# EAGLE design pcb-name-card (EAGLE 7.5.0)
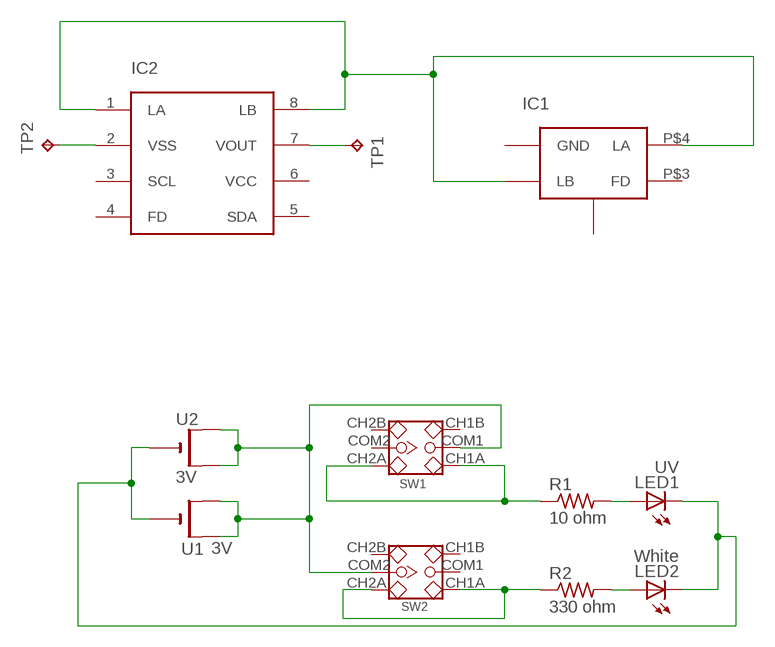
[diagram p0: schematic, sheet 1]

## Parts
IC1  NTAG21XFDRC-FIT  [HXSON4-SMALL]
IC2  NT3H1X01W0FTT  [TSSOP-8]
LED1  UV  LY_T679-D2E2-1  [PLCC2]
LED2  White  LY_T679-D2E2-1  [PLCC2]
R1  10 ohm  R-US_R2010  [R2010]
R2  330 ohm  R-US_R2010  [R2010]
SW1  SMD-TOGGLE-SWITCH-2CH(2X3P-7X3.5MM)  [SW6-2.54-SMD-7.0X3.5X1.5MM]
SW2  SMD-TOGGLE-SWITCH-2CH(2X3P-7X3.5MM)  [SW6-2.54-SMD-7.0X3.5X1.5MM]
TP1  VOUT  TPB2,54  [B2,54]
TP2  GND  TPB2,54  [B2,54]
U1  3V  CR2032SMT  [CR2032-SMD]
U2  3V  CR2032SMT  [CR2032-SMD]

## Nets
N$1: LED1.A R1.2
N$2: LED2.A R2.2
N$4: R1.1 SW1.CH1A SW1.CH2A
N$5: R2.1 SW2.CH1A SW2.CH2A
N$6: IC1.P$2(LB) IC1.P$4(LA) IC2.1(LA) IC2.8(LB)
N$7: LED1.C LED2.C U1.- U2.-
N$9: SW1.COM1 SW2.COM2 U1.+$1(+) U1.+$2(+1) U2.+$1(+) U2.+$2(+1)
N$10: IC2.2(VSS) TP2.TP
N$93: IC2.7(VOUT) TP1.TP
Unconnected: IC1.P$1(GND) IC1.P$3(FD) IC1.P$5(FLOAT) IC2.3(SCL) IC2.4(FD) IC2.5(SDA) IC2.6(VCC) SW1.CH1B SW1.CH2B SW1.COM2 SW2.CH1B SW2.CH2B SW2.COM1

## Library data of the parts
IC1 = ntag21xf:NTAG21XF
IC2 = ntagi2c:NT3H1X01
LED1 LED2 = led:*_T679-?-1: LC TOPLED® Low Current LED Source: http://catalog.osram-os.com .. LG_LS_LY_T679_OBS.pdf; COLOR: yellow
R1 R2 = resistor:R-US_: RESISTOR, American symbol
SW1 SW2 = Seeed-OPL-Switch:SMD-TOGGLE-SWITCH-2CH(2X3P-7X3.5MM): 311030005; MPN: MS-22C01
TP1 TP2 = testpad:TP: Test pad
U1 U2 = cr2032-large-side:CR2032

## Board
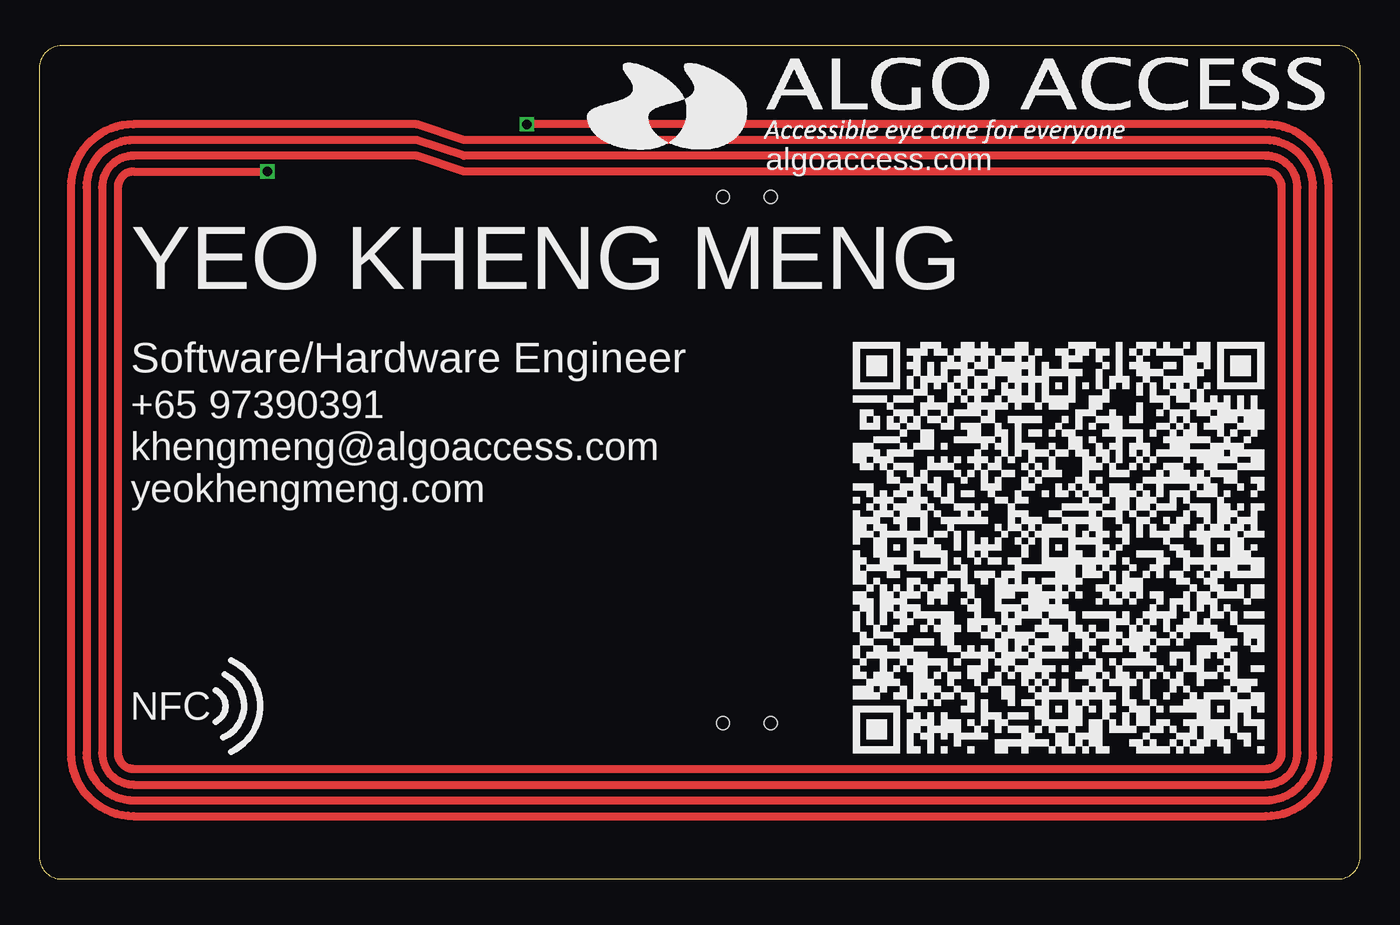
[diagram p1: board, top side]
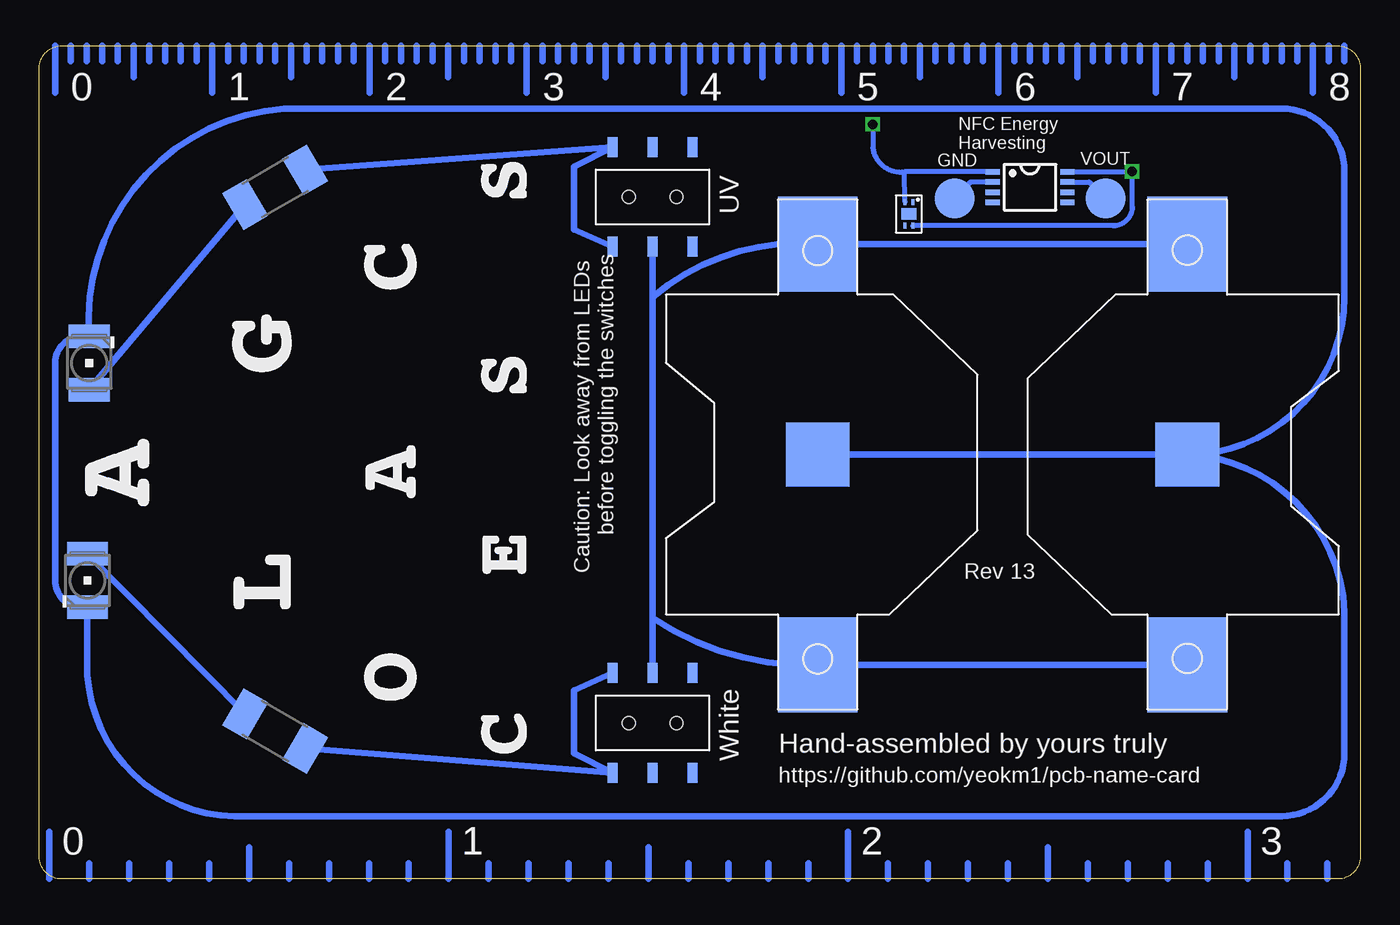
[diagram p2: board, bottom side, seen from below]

Size 84 x 53 mm. Coordinates in mm from the lower left corner, seen from the top.
Outline: 1.41,0 82.59,0 arc90 84,1.41 84,51.59 arc90 82.59,53 1.41,53 arc90 0,51.59 0,1.41 arc90 1.41,0
Copper layers (1*16): Top 0.035mm / dielectric 1.5mm / Bottom 0.035mm
Design rules "Elecrow_2-layer_eagle_rule": minimum track width 6mil, minimum drill 12mil, track to track 6mil, track to pad 6mil, pad to pad 6mil, via to via 6mil, smd to smd 0mil, copper to edge 10mil, drill to drill 10mil, minimum pad ring 10mil, minimum via ring 6mil, stop-mask expansion 2mil, vias tented up to drill 100mil, thermal gap 10mil

### Footprints (pad centres in the part's own frame; a part is rotated, then mirrored left to right if it is on the bottom)
HXSON4-SMALL = smd 0.4 x 0.2: P$1 -0.75,0.25; P$2 -0.75,-0.25; P$3 0.75,-0.25; P$4 0.75,0.25 | smd 0.75 x 0.95: P$5 0,0
TSSOP-8 = smd 0.9 x 0.35: 1 -2.375,0.975; 2 -2.375,0.325; 3 -2.375,-0.325; 4 -2.375,-0.975; 5 2.375,-0.975; 6 2.375,-0.325; 7 2.375,0.325; 8 2.375,0.975
PLCC2 = smd 2.6 x 1.5: A 0,1.7; C 0,-1.7
R2010 = smd 1.8 x 2.7: 1 -2.2,0; 2 2.2,0
SW6-2.54-SMD-7.0X3.5X1.5MM = smd 1.27 x 0.635: CH1A -3.175,2.54; CH1B -3.175,-2.54; CH2A 3.175,2.54; CH2B 3.175,-2.54; COM1 -3.175,0; COM2 3.175,0 | hole 0.813: 0,1.524; 0,-1.524
B2,54 = smd 2.54 x 2.54: TP 0,0
CR2032-SMD = smd 6.04 x 5.08: +$1 -13.39,0; +$2 13.38,0 | smd 4.064 x 4.064: - 0,0

### Placement (x,y rotation side)
IC1  28.7,42.3 270 bottom
IC2  21,44 0 bottom
LED1  80.82,32.81 180 bottom
LED2  80.94,18.98 0 bottom
R1  69,44 210 bottom
R2  69,9.4 150 bottom
SW1  45,43.38 90 bottom
SW2  45,9.92 90 bottom
TP1  16.2,43.3 0 bottom
TP2  25.8,43.3 0 bottom
U1  11,27 270 bottom
U2  34.5,27 90 bottom

### Tracks (layer width: path | path; a pad name or v marks a point on that pad's centre or on a via)
N$1
  Bottom 0.406: R1.2 LED1.A
N$2
  Bottom 0.406: R2.2 LED2.A
N$4
  Bottom 0.406: R1.1 SW1.CH2A 50,45.3 50,41.3 SW1.CH1A
N$5
  Bottom 0.406: R2.1 SW2.CH1A 50,8 50,12 SW2.CH2A
N$6  (via drill 0.6)
  Top 0.5: v14.5,45 6,45 arc90 5,44 5,8 arc90 6,7 78,7 arc90 79,8 79,44 arc90 78,45 27,45 24,46 6,46 arc90 4,44 4,8 arc90 6,6 78,6 arc90 80,8 80,44 arc90 78,46 27,46 24,47 6,47 arc90 3,44 3,8 arc90 6,5 78,5 arc90 81,8 81,44 arc90 78,47 27,47 24,48 6,48 arc90 2,44 2,8 arc90 6,4 78,4 arc90 82,8 82,44 arc90 78,48 v31,48
  Bottom 0.305: IC2.1 28.98,44.98 | IC1.P$4 15.7,41.55 arc-90 14.5,42.75 v14.5,45 14.5,44.98 IC2.8 | IC1.P$2 28.98,44.98 | v31,48 31,46.5 arc-90 28.98,44.98
N$7
  Bottom 0.406: 31.24,27 U2.- U1.- | U1.- arc85 1,17 1,8 arc90 5,4 70.7,4 arc90 80.94,12.94 LED2.C arc100 83,19 83,33 arc90 81,34.5 | U1.- arc-90 1,37 1,45 arc-90 5,49 68.44,49 arc-90 LED1.C
N$8
  Bottom 0.406: 83,53 83,50
N$9
  Bottom 0.406: U1.+$1 U2.+$2 arc-45 45,37 | U1.+$2 U2.+$1 arc36 45,16.6 | SW1.COM1 45,37 | 45,37 45,16.6 | 45,16.6 SW2.COM2
N$10
  Bottom 0.305: IC2.2 24.77,44.33 TP2.TP
N$11
  Bottom 0.406: 1,53 1,52
N$12
  Bottom 0.406: 2,53 2,52
N$13
  Bottom 0.406: 78,53 78,51
N$14
  Bottom 0.406: 4,53 4,52
N$15
  Bottom 0.406: 5,53 5,52
N$16
  Bottom 0.406: 6,53 6,52
N$17
  Bottom 0.406: 7,53 7,52
N$18
  Bottom 0.406: 68,53 68,51
N$19
  Bottom 0.406: 9,53 9,52
N$20
  Bottom 0.406: 10,53 10,52
N$21
  Bottom 0.406: 11,53 11,52
N$22
  Bottom 0.406: 12,53 12,52
N$23
  Bottom 0.406: 58,53 58,51
N$24
  Bottom 0.406: 14,53 14,52
N$25
  Bottom 0.406: 15,53 15,52
N$26
  Bottom 0.406: 16,53 16,52
N$27
  Bottom 0.406: 17,53 17,52
N$28
  Bottom 0.406: 48,53 48,51
N$29
  Bottom 0.406: 19,53 19,52
N$30
  Bottom 0.406: 20,53 20,52
N$31
  Bottom 0.406: 21,53 21,52
N$32
  Bottom 0.406: 22,53 22,52
N$33
  Bottom 0.406: 23,53 23,50
N$34
  Bottom 0.406: 24,53 24,52
N$35
  Bottom 0.406: 25,53 25,52
N$36
  Bottom 0.406: 26,53 26,52
N$37
  Bottom 0.406: 27,53 27,52
N$38
  Bottom 0.406: 38,53 38,51
N$39
  Bottom 0.406: 29,53 29,52
N$40
  Bottom 0.406: 30,53 30,52
N$41
  Bottom 0.406: 31,53 31,52
N$42
  Bottom 0.406: 32,53 32,52
N$43
  Bottom 0.406: 33,53 33,50
N$44
  Bottom 0.406: 34,53 34,52
N$45
  Bottom 0.406: 35,53 35,52
N$46
  Bottom 0.406: 36,53 36,52
N$47
  Bottom 0.406: 37,53 37,52
N$48
  Bottom 0.406: 28,53 28,51
N$49
  Bottom 0.406: 39,53 39,52
N$50
  Bottom 0.406: 40,53 40,52
N$51
  Bottom 0.406: 41,53 41,52
N$52
  Bottom 0.406: 42,53 42,52
N$53
  Bottom 0.406: 43,53 43,50
N$54
  Bottom 0.406: 44,53 44,52
N$55
  Bottom 0.406: 45,53 45,52
N$56
  Bottom 0.406: 46,53 46,52
N$57
  Bottom 0.406: 47,53 47,52
N$58
  Bottom 0.406: 18,53 18,51
N$59
  Bottom 0.406: 49,53 49,52
N$60
  Bottom 0.406: 50,53 50,52
N$61
  Bottom 0.406: 51,53 51,52
N$62
  Bottom 0.406: 52,53 52,52
N$63
  Bottom 0.406: 53,53 53,50
N$64
  Bottom 0.406: 54,53 54,52
N$65
  Bottom 0.406: 55,53 55,52
N$66
  Bottom 0.406: 56,53 56,52
N$67
  Bottom 0.406: 57,53 57,52
N$68
  Bottom 0.406: 13,53 13,50
N$69
  Bottom 0.406: 59,53 59,52
N$70
  Bottom 0.406: 60,53 60,52
N$71
  Bottom 0.406: 61,53 61,52
N$72
  Bottom 0.406: 62,53 62,52
N$73
  Bottom 0.406: 63,53 63,50
N$74
  Bottom 0.406: 64,53 64,52
N$75
  Bottom 0.406: 65,53 65,52
N$76
  Bottom 0.406: 66,53 66,52
N$77
  Bottom 0.406: 67,53 67,52
N$78
  Bottom 0.406: 8,53 8,51
N$79
  Bottom 0.406: 69,53 69,52
N$80
  Bottom 0.406: 70,53 70,52
N$81
  Bottom 0.406: 71,53 71,52
N$82
  Bottom 0.406: 72,53 72,52
N$83
  Bottom 0.406: 73,53 73,50
N$84
  Bottom 0.406: 74,53 74,52
N$85
  Bottom 0.406: 75,53 75,52
N$86
  Bottom 0.406: 76,53 76,52
N$87
  Bottom 0.406: 77,53 77,52
N$88
  Bottom 0.406: 3,53 3,50
N$89
  Bottom 0.406: 79,53 79,52
N$90
  Bottom 0.406: 80,53 80,52
N$91
  Bottom 0.406: 81,53 81,52
N$92
  Bottom 0.406: 82,53 82,52
N$93
  Bottom 0.305: IC2.7 17.23,44.33 TP1.TP
N$94
  Bottom 0.406: 83.36,0 83.36,3
N$95
  Bottom 0.406: 80.82,0 80.82,1
N$96
  Bottom 0.406: 78.28,0 78.28,1
N$97
  Bottom 0.406: 75.74,0 75.74,1
N$98
  Bottom 0.406: 73.2,0 73.2,1
N$99
  Bottom 0.406: 70.66,0 70.66,2
N$100
  Bottom 0.406: 68.12,0 68.12,1
N$101
  Bottom 0.406: 65.58,0 65.58,1
N$102
  Bottom 0.406: 63.04,0 63.04,1
N$103
  Bottom 0.406: 60.5,0 60.5,1
N$104
  Bottom 0.406: 57.96,0 57.96,3
N$105
  Bottom 0.406: 55.42,0 55.42,1
N$106
  Bottom 0.406: 52.88,0 52.88,1
N$107
  Bottom 0.406: 50.34,0 50.34,1
N$108
  Bottom 0.406: 47.8,0 47.8,1
N$109
  Bottom 0.406: 45.26,0 45.26,2
N$110
  Bottom 0.406: 42.72,0 42.72,1
N$111
  Bottom 0.406: 40.18,0 40.18,1
N$112
  Bottom 0.406: 37.64,0 37.64,1
N$113
  Bottom 0.406: 35.1,0 35.1,1
N$114
  Bottom 0.406: 32.56,0 32.56,3
N$115
  Bottom 0.406: 30.02,0 30.02,1
N$116
  Bottom 0.406: 27.48,0 27.48,1
N$117
  Bottom 0.406: 24.94,0 24.94,1
N$118
  Bottom 0.406: 22.4,0 22.4,1
N$119
  Bottom 0.406: 19.86,0 19.86,2
N$120
  Bottom 0.406: 17.32,0 17.32,1
N$121
  Bottom 0.406: 14.78,0 14.78,1
N$122
  Bottom 0.406: 12.24,0 12.24,1
N$123
  Bottom 0.406: 9.7,0 9.7,1
N$124
  Bottom 0.406: 7.16,0 7.16,3
N$125
  Bottom 0.406: 4.62,1 4.62,0
N$126
  Bottom 0.406: 2.08,0 2.08,1

### Text on the board
tPlace: algoaccess.com | YEO KHENG MENG | Software/Hardware Engineer | +65 97390391 / khengmeng@algoaccess.com / yeokhengmeng.com | NFC
bPlace: 8 | 7 | 6 | 5 | 4 | 3 | 2 | 1 | 0 | NFC Energy / Harvesting | UV | Caution: Look away from LEDs / before toggling the switches | Rev 13 | Hand-assembled by yours truly | White | https://github.com/yeokm1/pcb-name-card | 3 | 2 | 1 | 0